# Altium schematic sheet usb.SchDoc
size A4
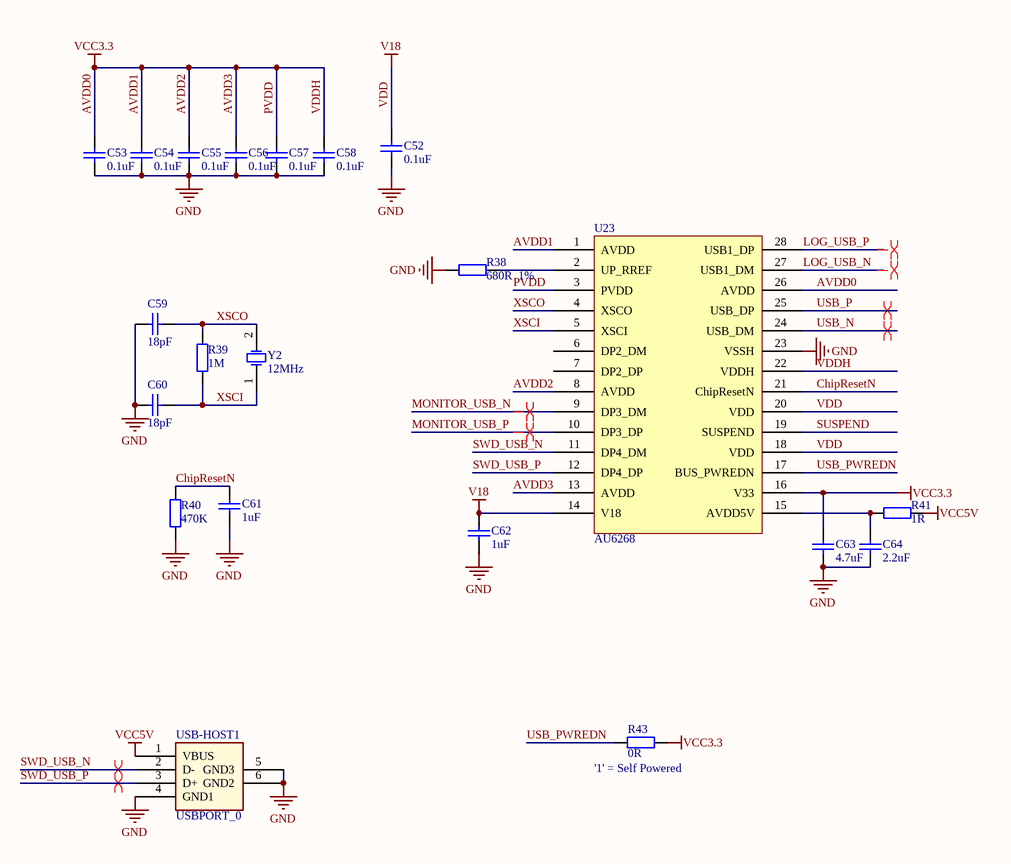
[diagram p0: usb.SchDoc]

## Parts
C52  0.1uF  [0603_C]
C53  0.1uF  [0603_C]
C54  0.1uF  [0603_C]
C55  0.1uF  [0603_C]
C56  0.1uF  [0603_C]
C57  0.1uF  [0603_C]
C58  0.1uF  [0603_C]
C59  18pF  [0603_C]
C60  18pF  [0603_C]
C61  1uF  [0603_C]
C62  1uF  [0603_C]
C63  4.7uF  [0603_C]
C64  2.2uF  [0603_C]
R38  680R  1%  [0603_R]
R39  1M  [0603_R]
R40  470K  [0603_R]
R41  1R  [0603_R]
R43  0R  [0603_R]
U23  AU6268  [SSOP-28_208mil]
USB-HOST1  USBPORT_0  [USB-A-TH_USB-DIP-04F-S1-B1-Y2]
Y2  12MHz  [LC-HC-49SMD]

## Nets
AVDD0: C53.2 C54.2 C55.2 C56.2 C57.2 C58.2 C63.2 R43.1 U23.1(AVDD) U23.3(PVDD) U23.8(AVDD) U23.13(AVDD) U23.16(V33) U23.22(VDDH) U23.26(AVDD)  [also labelled AVDD1, AVDD2, AVDD3, PVDD, VCC3.3, VDDH]
GND: C52.1 C53.1 C54.1 C55.1 C56.1 C57.1 C58.1 C59.2 C60.2 C61.1 C62.1 C63.1 C64.1 R38.1 R40.1 U23.23(VSSH) USB-HOST1.4(GND1) USB-HOST1.5(GND3) USB-HOST1.6(GND2)
VCC5V: R41.2 USB-HOST1.1(VBUS)
VDD: C52.2 C62.2 U23.14(V18) U23.18(VDD) U23.20(VDD)  [also labelled V18]
ChipResetN: C61.2 R40.2 U23.21(ChipResetN)
LOG_USB_N: U23.27(USB1_DM)
LOG_USB_P: U23.28(USB1_DP)
MONITOR_USB_N: U23.9(DP3_DM)
MONITOR_USB_P: U23.10(DP3_DP)
SUSPEND: U23.19(SUSPEND)
SWD_USB_N: U23.11(DP4_DM) USB-HOST1.2(D-)
SWD_USB_P: U23.12(DP4_DP) USB-HOST1.3(D+)
USB_N: U23.24(USB_DM)
USB_P: U23.25(USB_DP)
USB_PWREDN: R43.2 U23.17(BUS_PWREDN)
XSCI: C60.1 R39.1 U23.5(XSCI) Y2.1(OSC1)
XSCO: C59.1 R39.2 U23.4(XSCO) Y2.2(OSC2)
NetC64_2: C64.2 R41.1 U23.15(AVDD5V)
NetR38_2: R38.2 U23.2(UP_RREF)

Not connected (* = marked no-connect by the designer): U23 6(DP2_DM) 7(DP2_DP)

## Layout directives
differential pair: LOG_USB_N, LOG_USB_P, MONITOR_USB_N, MONITOR_USB_P, SWD_USB_N, SWD_USB_P, USB_N, USB_P

## Notes on the sheet
- (near R43) '1' = Self Powered

## Library data of the parts
C52-C64 = Cap: 贴片电容，0603
R38-R41 R43 = Res2: 贴片电阻，0603
U23 = AU6268: AU6268,SSOP28封装
USB-HOST1 = USBPORT_0: USB - A 插座 ,直角,292303-1
Y2 = XTAL: 贴片晶振，49SMD